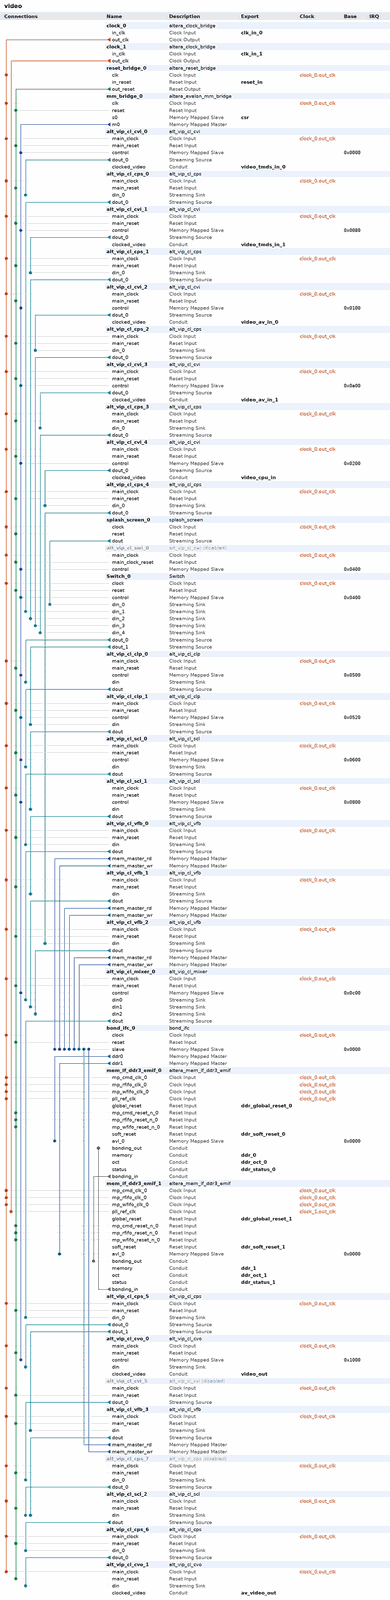
[diagram p0: system contents, whole]
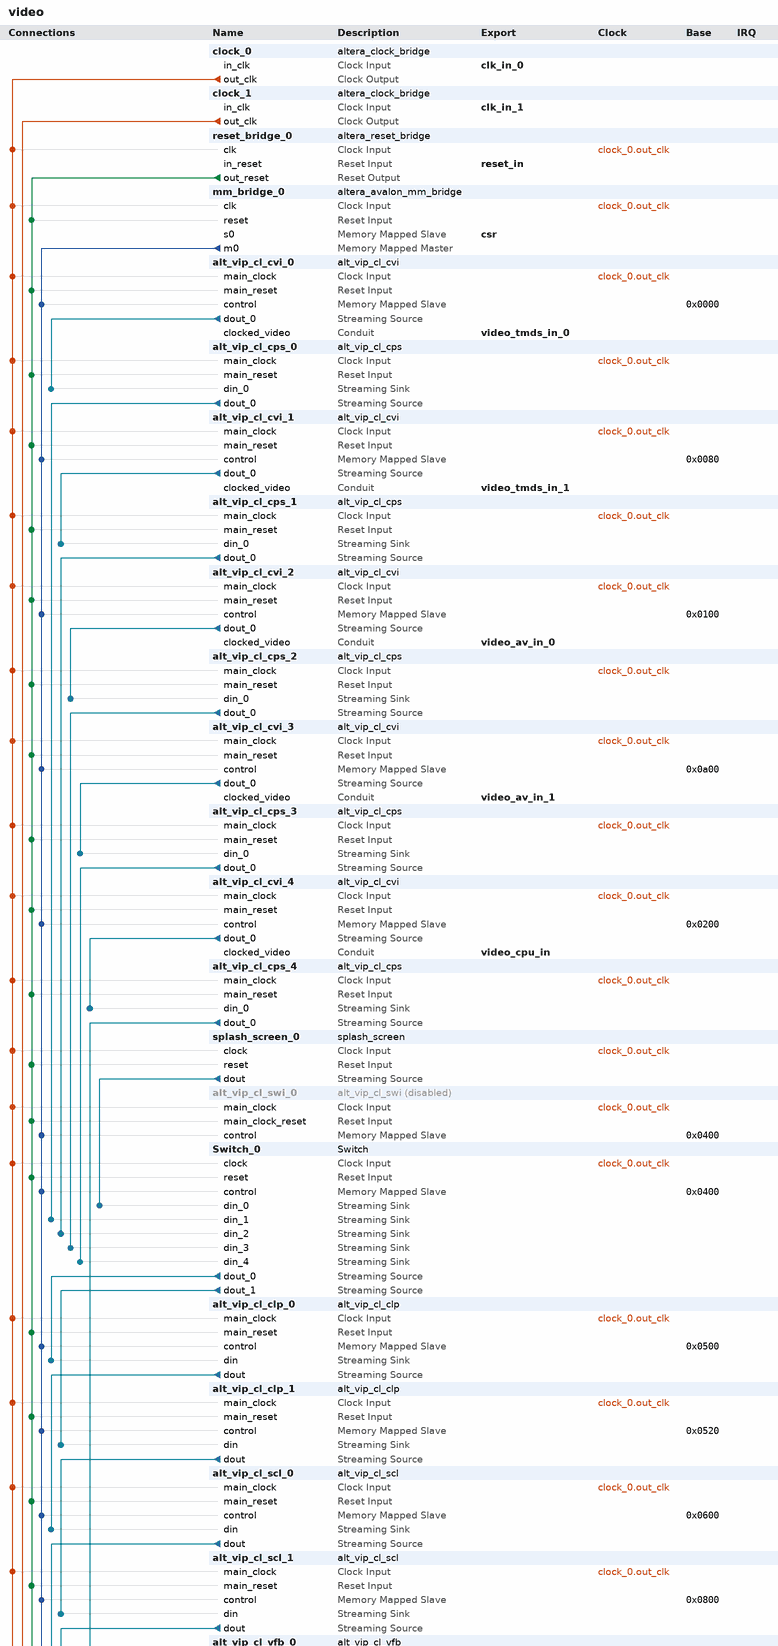
[diagram p1: system contents, upper part]
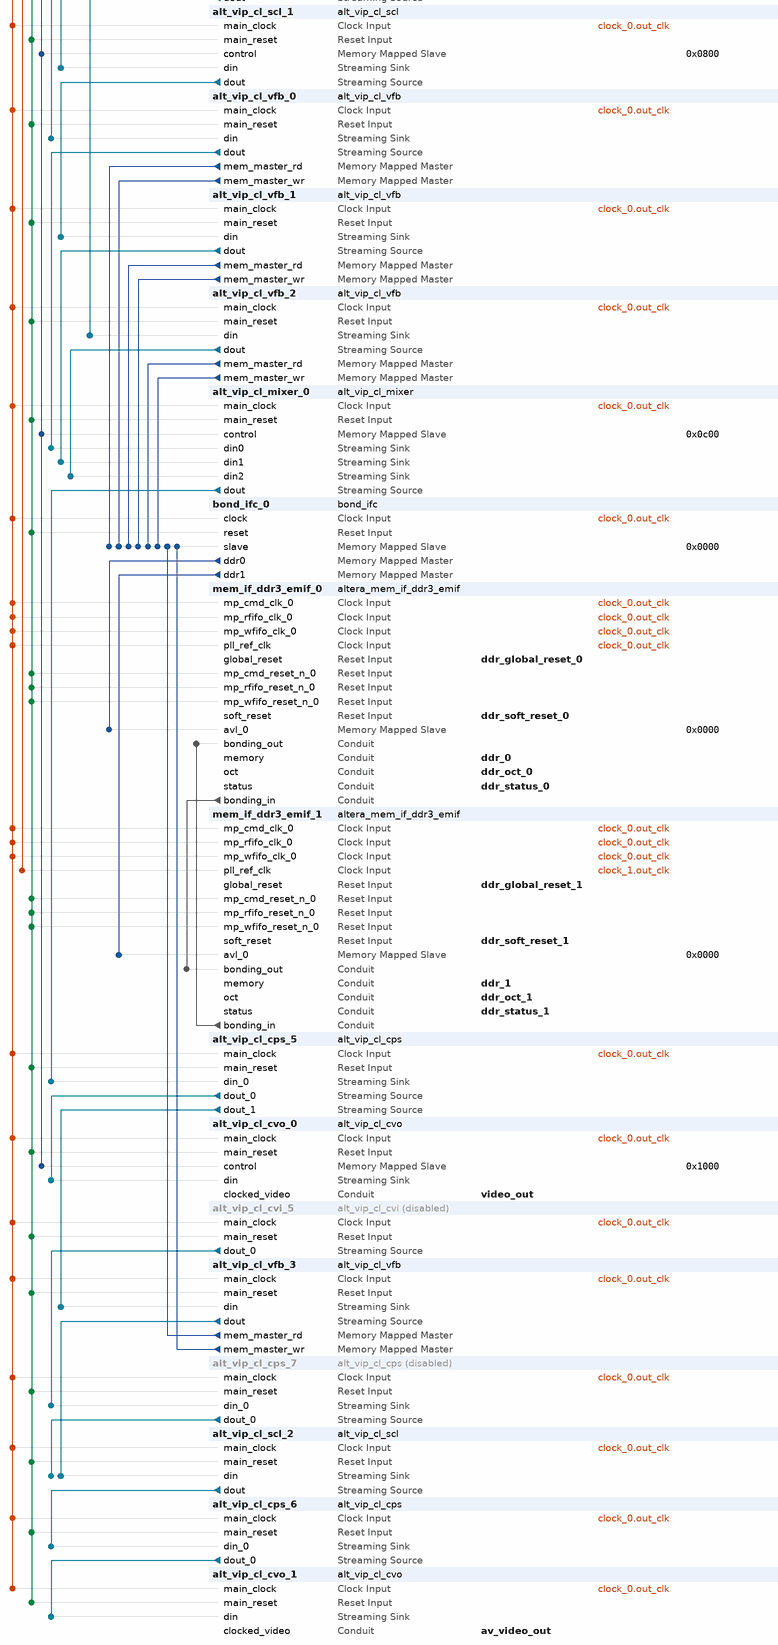
[diagram p2: system contents, lower part]
# Platform Designer (Qsys) system video, Cyclone V 5CGXFC7D6F31I7
# Parameters at their usual value, and those the tool derives, are not listed.
package require -exact qsys 18.1
create_system video
set_project_property DEVICE_FAMILY {Cyclone V}
set_project_property DEVICE 5CGXFC7D6F31I7

add_instance clock_0 altera_clock_bridge 18.1
set_instance_parameter_value clock_0 DERIVED_CLOCK_RATE 0
set_instance_parameter_value clock_0 EXPLICIT_CLOCK_RATE 100000000

add_instance clock_1 altera_clock_bridge 18.1
set_instance_parameter_value clock_1 DERIVED_CLOCK_RATE 0
set_instance_parameter_value clock_1 EXPLICIT_CLOCK_RATE 100000000

add_instance reset_bridge_0 altera_reset_bridge 18.1
set_instance_parameter_value reset_bridge_0 ACTIVE_LOW_RESET 1
set_instance_parameter_value reset_bridge_0 SYNCHRONOUS_EDGES deassert

add_instance mm_bridge_0 altera_avalon_mm_bridge 18.1
set_instance_parameter_value mm_bridge_0 ADDRESS_UNITS WORDS
set_instance_parameter_value mm_bridge_0 ADDRESS_WIDTH 10
set_instance_parameter_value mm_bridge_0 DATA_WIDTH 32
set_instance_parameter_value mm_bridge_0 MAX_PENDING_RESPONSES 4
set_instance_parameter_value mm_bridge_0 USE_AUTO_ADDRESS_WIDTH 1

add_instance alt_vip_cl_cvi_0 alt_vip_cl_cvi 18.1
set_instance_parameter_value alt_vip_cl_cvi_0 ACCEPT_COLOURS_IN_SEQ 0
set_instance_parameter_value alt_vip_cl_cvi_0 ANC_DEPTH 1
set_instance_parameter_value alt_vip_cl_cvi_0 BPS 8
set_instance_parameter_value alt_vip_cl_cvi_0 CLOCKS_ARE_SAME 0
set_instance_parameter_value alt_vip_cl_cvi_0 COLOUR_PLANES_ARE_IN_PARALLEL 1
set_instance_parameter_value alt_vip_cl_cvi_0 EXTRACT_TOTAL_RESOLUTION 1
set_instance_parameter_value alt_vip_cl_cvi_0 FIFO_DEPTH 128
set_instance_parameter_value alt_vip_cl_cvi_0 GENERATE_ANC 0
set_instance_parameter_value alt_vip_cl_cvi_0 GENERATE_VID_F 0
set_instance_parameter_value alt_vip_cl_cvi_0 H_ACTIVE_PIXELS_F0 1920
set_instance_parameter_value alt_vip_cl_cvi_0 INTERLACED 0
set_instance_parameter_value alt_vip_cl_cvi_0 MATCH_CTRLDATA_PKT_CLIP_BASIC 0
set_instance_parameter_value alt_vip_cl_cvi_0 MATCH_CTRLDATA_PKT_PAD_ADV 0
set_instance_parameter_value alt_vip_cl_cvi_0 NO_OF_CHANNELS 1
set_instance_parameter_value alt_vip_cl_cvi_0 NUMBER_OF_COLOUR_PLANES 3
set_instance_parameter_value alt_vip_cl_cvi_0 OVERFLOW_HANDLING 0
set_instance_parameter_value alt_vip_cl_cvi_0 PIXELS_IN_PARALLEL 2
set_instance_parameter_value alt_vip_cl_cvi_0 STD_WIDTH 1
set_instance_parameter_value alt_vip_cl_cvi_0 SYNC_TO 0
set_instance_parameter_value alt_vip_cl_cvi_0 USE_CONTROL 1
set_instance_parameter_value alt_vip_cl_cvi_0 USE_EMBEDDED_SYNCS 0
set_instance_parameter_value alt_vip_cl_cvi_0 USE_HDMI_DEPRICATION 0
set_instance_parameter_value alt_vip_cl_cvi_0 USE_STD 0
set_instance_parameter_value alt_vip_cl_cvi_0 V_ACTIVE_LINES_F0 1080
set_instance_parameter_value alt_vip_cl_cvi_0 V_ACTIVE_LINES_F1 480

add_instance alt_vip_cl_cps_0 alt_vip_cl_cps 18.1
set_instance_parameter_value alt_vip_cl_cps_0 BITS_PER_SYMBOL 8
set_instance_parameter_value alt_vip_cl_cps_0 EXTRA_PIPELINING 0
set_instance_parameter_value alt_vip_cl_cps_0 INPUT_0_COLOR_PLANES_ARE_IN_PARALLEL 1
set_instance_parameter_value alt_vip_cl_cps_0 INPUT_0_FIFO 0
set_instance_parameter_value alt_vip_cl_cps_0 INPUT_0_FIFO_SIZE 8
set_instance_parameter_value alt_vip_cl_cps_0 INPUT_0_NUMBER_OF_COLOR_PLANES 3
set_instance_parameter_value alt_vip_cl_cps_0 INPUT_0_PATTERN C0,C1,C2
set_instance_parameter_value alt_vip_cl_cps_0 INPUT_0_PIXELS_IN_PARALLEL 2
set_instance_parameter_value alt_vip_cl_cps_0 INPUT_0_TWO_PIXELS_PATTERN 0
set_instance_parameter_value alt_vip_cl_cps_0 INPUT_1_COLOR_PLANES_ARE_IN_PARALLEL 1
set_instance_parameter_value alt_vip_cl_cps_0 INPUT_1_FIFO 0
set_instance_parameter_value alt_vip_cl_cps_0 INPUT_1_FIFO_SIZE 8
set_instance_parameter_value alt_vip_cl_cps_0 INPUT_1_NUMBER_OF_COLOR_PLANES 3
set_instance_parameter_value alt_vip_cl_cps_0 INPUT_1_PATTERN C0,C1,C2
set_instance_parameter_value alt_vip_cl_cps_0 INPUT_1_PIXELS_IN_PARALLEL 1
set_instance_parameter_value alt_vip_cl_cps_0 INPUT_1_TWO_PIXELS_PATTERN 0
set_instance_parameter_value alt_vip_cl_cps_0 INPUT_VALIDATION 1
set_instance_parameter_value alt_vip_cl_cps_0 NUMBER_OF_INPUTS 1
set_instance_parameter_value alt_vip_cl_cps_0 NUMBER_OF_OUTPUTS 1
set_instance_parameter_value alt_vip_cl_cps_0 OUTPUT_0_COLOR_PLANES_ARE_IN_PARALLEL 1
set_instance_parameter_value alt_vip_cl_cps_0 OUTPUT_0_FIFO 0
set_instance_parameter_value alt_vip_cl_cps_0 OUTPUT_0_FIFO_SIZE 8
set_instance_parameter_value alt_vip_cl_cps_0 OUTPUT_0_NUMBER_OF_COLOR_PLANES 3
set_instance_parameter_value alt_vip_cl_cps_0 OUTPUT_0_PATTERN C0,C1,C2
set_instance_parameter_value alt_vip_cl_cps_0 OUTPUT_0_PIXELS_IN_PARALLEL 4
set_instance_parameter_value alt_vip_cl_cps_0 OUTPUT_0_TWO_PIXELS_PATTERN 0
set_instance_parameter_value alt_vip_cl_cps_0 OUTPUT_1_COLOR_PLANES_ARE_IN_PARALLEL 1
set_instance_parameter_value alt_vip_cl_cps_0 OUTPUT_1_FIFO 0
set_instance_parameter_value alt_vip_cl_cps_0 OUTPUT_1_FIFO_SIZE 8
set_instance_parameter_value alt_vip_cl_cps_0 OUTPUT_1_NUMBER_OF_COLOR_PLANES 3
set_instance_parameter_value alt_vip_cl_cps_0 OUTPUT_1_PATTERN C0,C1,C2
set_instance_parameter_value alt_vip_cl_cps_0 OUTPUT_1_PIXELS_IN_PARALLEL 1
set_instance_parameter_value alt_vip_cl_cps_0 OUTPUT_1_TWO_PIXELS_PATTERN 0
set_instance_parameter_value alt_vip_cl_cps_0 OUTPUT_VALIDATION 1
set_instance_parameter_value alt_vip_cl_cps_0 USER_PACKET_SUPPORT NONE_ALLOWED
set_instance_parameter_value alt_vip_cl_cps_0 USER_PKT_0_TO_0 0
set_instance_parameter_value alt_vip_cl_cps_0 USER_PKT_0_TO_1 0
set_instance_parameter_value alt_vip_cl_cps_0 USER_PKT_1_TO_0 0
set_instance_parameter_value alt_vip_cl_cps_0 USER_PKT_1_TO_1 1

add_instance alt_vip_cl_cvi_1 alt_vip_cl_cvi 18.1
set_instance_parameter_value alt_vip_cl_cvi_1 ACCEPT_COLOURS_IN_SEQ 0
set_instance_parameter_value alt_vip_cl_cvi_1 ANC_DEPTH 1
set_instance_parameter_value alt_vip_cl_cvi_1 BPS 8
set_instance_parameter_value alt_vip_cl_cvi_1 CLOCKS_ARE_SAME 0
set_instance_parameter_value alt_vip_cl_cvi_1 COLOUR_PLANES_ARE_IN_PARALLEL 1
set_instance_parameter_value alt_vip_cl_cvi_1 EXTRACT_TOTAL_RESOLUTION 1
set_instance_parameter_value alt_vip_cl_cvi_1 FIFO_DEPTH 128
set_instance_parameter_value alt_vip_cl_cvi_1 GENERATE_ANC 0
set_instance_parameter_value alt_vip_cl_cvi_1 GENERATE_VID_F 0
set_instance_parameter_value alt_vip_cl_cvi_1 H_ACTIVE_PIXELS_F0 1920
set_instance_parameter_value alt_vip_cl_cvi_1 INTERLACED 0
set_instance_parameter_value alt_vip_cl_cvi_1 MATCH_CTRLDATA_PKT_CLIP_BASIC 0
set_instance_parameter_value alt_vip_cl_cvi_1 MATCH_CTRLDATA_PKT_PAD_ADV 0
set_instance_parameter_value alt_vip_cl_cvi_1 NO_OF_CHANNELS 1
set_instance_parameter_value alt_vip_cl_cvi_1 NUMBER_OF_COLOUR_PLANES 3
set_instance_parameter_value alt_vip_cl_cvi_1 OVERFLOW_HANDLING 0
set_instance_parameter_value alt_vip_cl_cvi_1 PIXELS_IN_PARALLEL 2
set_instance_parameter_value alt_vip_cl_cvi_1 STD_WIDTH 1
set_instance_parameter_value alt_vip_cl_cvi_1 SYNC_TO 0
set_instance_parameter_value alt_vip_cl_cvi_1 USE_CONTROL 1
set_instance_parameter_value alt_vip_cl_cvi_1 USE_EMBEDDED_SYNCS 0
set_instance_parameter_value alt_vip_cl_cvi_1 USE_HDMI_DEPRICATION 0
set_instance_parameter_value alt_vip_cl_cvi_1 USE_STD 0
set_instance_parameter_value alt_vip_cl_cvi_1 V_ACTIVE_LINES_F0 1080
set_instance_parameter_value alt_vip_cl_cvi_1 V_ACTIVE_LINES_F1 480

add_instance alt_vip_cl_cps_1 alt_vip_cl_cps 18.1
set_instance_parameter_value alt_vip_cl_cps_1 BITS_PER_SYMBOL 8
set_instance_parameter_value alt_vip_cl_cps_1 EXTRA_PIPELINING 0
set_instance_parameter_value alt_vip_cl_cps_1 INPUT_0_COLOR_PLANES_ARE_IN_PARALLEL 1
set_instance_parameter_value alt_vip_cl_cps_1 INPUT_0_FIFO 0
set_instance_parameter_value alt_vip_cl_cps_1 INPUT_0_FIFO_SIZE 8
set_instance_parameter_value alt_vip_cl_cps_1 INPUT_0_NUMBER_OF_COLOR_PLANES 3
set_instance_parameter_value alt_vip_cl_cps_1 INPUT_0_PATTERN C0,C1,C2
set_instance_parameter_value alt_vip_cl_cps_1 INPUT_0_PIXELS_IN_PARALLEL 2
set_instance_parameter_value alt_vip_cl_cps_1 INPUT_0_TWO_PIXELS_PATTERN 0
set_instance_parameter_value alt_vip_cl_cps_1 INPUT_1_COLOR_PLANES_ARE_IN_PARALLEL 1
set_instance_parameter_value alt_vip_cl_cps_1 INPUT_1_FIFO 0
set_instance_parameter_value alt_vip_cl_cps_1 INPUT_1_FIFO_SIZE 8
set_instance_parameter_value alt_vip_cl_cps_1 INPUT_1_NUMBER_OF_COLOR_PLANES 3
set_instance_parameter_value alt_vip_cl_cps_1 INPUT_1_PATTERN C0,C1,C2
set_instance_parameter_value alt_vip_cl_cps_1 INPUT_1_PIXELS_IN_PARALLEL 1
set_instance_parameter_value alt_vip_cl_cps_1 INPUT_1_TWO_PIXELS_PATTERN 0
set_instance_parameter_value alt_vip_cl_cps_1 INPUT_VALIDATION 1
set_instance_parameter_value alt_vip_cl_cps_1 NUMBER_OF_INPUTS 1
set_instance_parameter_value alt_vip_cl_cps_1 NUMBER_OF_OUTPUTS 1
set_instance_parameter_value alt_vip_cl_cps_1 OUTPUT_0_COLOR_PLANES_ARE_IN_PARALLEL 1
set_instance_parameter_value alt_vip_cl_cps_1 OUTPUT_0_FIFO 0
set_instance_parameter_value alt_vip_cl_cps_1 OUTPUT_0_FIFO_SIZE 8
set_instance_parameter_value alt_vip_cl_cps_1 OUTPUT_0_NUMBER_OF_COLOR_PLANES 3
set_instance_parameter_value alt_vip_cl_cps_1 OUTPUT_0_PATTERN C0,C1,C2
set_instance_parameter_value alt_vip_cl_cps_1 OUTPUT_0_PIXELS_IN_PARALLEL 4
set_instance_parameter_value alt_vip_cl_cps_1 OUTPUT_0_TWO_PIXELS_PATTERN 0
set_instance_parameter_value alt_vip_cl_cps_1 OUTPUT_1_COLOR_PLANES_ARE_IN_PARALLEL 1
set_instance_parameter_value alt_vip_cl_cps_1 OUTPUT_1_FIFO 0
set_instance_parameter_value alt_vip_cl_cps_1 OUTPUT_1_FIFO_SIZE 8
set_instance_parameter_value alt_vip_cl_cps_1 OUTPUT_1_NUMBER_OF_COLOR_PLANES 3
set_instance_parameter_value alt_vip_cl_cps_1 OUTPUT_1_PATTERN C0,C1,C2
set_instance_parameter_value alt_vip_cl_cps_1 OUTPUT_1_PIXELS_IN_PARALLEL 1
set_instance_parameter_value alt_vip_cl_cps_1 OUTPUT_1_TWO_PIXELS_PATTERN 0
set_instance_parameter_value alt_vip_cl_cps_1 OUTPUT_VALIDATION 1
set_instance_parameter_value alt_vip_cl_cps_1 USER_PACKET_SUPPORT NONE_ALLOWED
set_instance_parameter_value alt_vip_cl_cps_1 USER_PKT_0_TO_0 0
set_instance_parameter_value alt_vip_cl_cps_1 USER_PKT_0_TO_1 0
set_instance_parameter_value alt_vip_cl_cps_1 USER_PKT_1_TO_0 0
set_instance_parameter_value alt_vip_cl_cps_1 USER_PKT_1_TO_1 1

add_instance alt_vip_cl_cvi_2 alt_vip_cl_cvi 18.1
set_instance_parameter_value alt_vip_cl_cvi_2 ACCEPT_COLOURS_IN_SEQ 0
set_instance_parameter_value alt_vip_cl_cvi_2 ANC_DEPTH 1
set_instance_parameter_value alt_vip_cl_cvi_2 BPS 8
set_instance_parameter_value alt_vip_cl_cvi_2 CLOCKS_ARE_SAME 0
set_instance_parameter_value alt_vip_cl_cvi_2 COLOUR_PLANES_ARE_IN_PARALLEL 1
set_instance_parameter_value alt_vip_cl_cvi_2 EXTRACT_TOTAL_RESOLUTION 1
set_instance_parameter_value alt_vip_cl_cvi_2 FIFO_DEPTH 2048
set_instance_parameter_value alt_vip_cl_cvi_2 GENERATE_ANC 0
set_instance_parameter_value alt_vip_cl_cvi_2 GENERATE_VID_F 0
set_instance_parameter_value alt_vip_cl_cvi_2 H_ACTIVE_PIXELS_F0 1920
set_instance_parameter_value alt_vip_cl_cvi_2 INTERLACED 0
set_instance_parameter_value alt_vip_cl_cvi_2 MATCH_CTRLDATA_PKT_CLIP_BASIC 0
set_instance_parameter_value alt_vip_cl_cvi_2 MATCH_CTRLDATA_PKT_PAD_ADV 0
set_instance_parameter_value alt_vip_cl_cvi_2 NO_OF_CHANNELS 1
set_instance_parameter_value alt_vip_cl_cvi_2 NUMBER_OF_COLOUR_PLANES 3
set_instance_parameter_value alt_vip_cl_cvi_2 OVERFLOW_HANDLING 0
set_instance_parameter_value alt_vip_cl_cvi_2 PIXELS_IN_PARALLEL 1
set_instance_parameter_value alt_vip_cl_cvi_2 STD_WIDTH 1
set_instance_parameter_value alt_vip_cl_cvi_2 SYNC_TO 0
set_instance_parameter_value alt_vip_cl_cvi_2 USE_CONTROL 1
set_instance_parameter_value alt_vip_cl_cvi_2 USE_EMBEDDED_SYNCS 0
set_instance_parameter_value alt_vip_cl_cvi_2 USE_HDMI_DEPRICATION 0
set_instance_parameter_value alt_vip_cl_cvi_2 USE_STD 0
set_instance_parameter_value alt_vip_cl_cvi_2 V_ACTIVE_LINES_F0 1080
set_instance_parameter_value alt_vip_cl_cvi_2 V_ACTIVE_LINES_F1 480

add_instance alt_vip_cl_cps_2 alt_vip_cl_cps 18.1
set_instance_parameter_value alt_vip_cl_cps_2 BITS_PER_SYMBOL 8
set_instance_parameter_value alt_vip_cl_cps_2 EXTRA_PIPELINING 0
set_instance_parameter_value alt_vip_cl_cps_2 INPUT_0_COLOR_PLANES_ARE_IN_PARALLEL 1
set_instance_parameter_value alt_vip_cl_cps_2 INPUT_0_FIFO 0
set_instance_parameter_value alt_vip_cl_cps_2 INPUT_0_FIFO_SIZE 128
set_instance_parameter_value alt_vip_cl_cps_2 INPUT_0_NUMBER_OF_COLOR_PLANES 3
set_instance_parameter_value alt_vip_cl_cps_2 INPUT_0_PATTERN C0,C1,C2
set_instance_parameter_value alt_vip_cl_cps_2 INPUT_0_PIXELS_IN_PARALLEL 1
set_instance_parameter_value alt_vip_cl_cps_2 INPUT_0_TWO_PIXELS_PATTERN 0
set_instance_parameter_value alt_vip_cl_cps_2 INPUT_1_COLOR_PLANES_ARE_IN_PARALLEL 1
set_instance_parameter_value alt_vip_cl_cps_2 INPUT_1_FIFO 0
set_instance_parameter_value alt_vip_cl_cps_2 INPUT_1_FIFO_SIZE 8
set_instance_parameter_value alt_vip_cl_cps_2 INPUT_1_NUMBER_OF_COLOR_PLANES 3
set_instance_parameter_value alt_vip_cl_cps_2 INPUT_1_PATTERN C0,C1,C2
set_instance_parameter_value alt_vip_cl_cps_2 INPUT_1_PIXELS_IN_PARALLEL 1
set_instance_parameter_value alt_vip_cl_cps_2 INPUT_1_TWO_PIXELS_PATTERN 0
set_instance_parameter_value alt_vip_cl_cps_2 INPUT_VALIDATION 1
set_instance_parameter_value alt_vip_cl_cps_2 NUMBER_OF_INPUTS 1
set_instance_parameter_value alt_vip_cl_cps_2 NUMBER_OF_OUTPUTS 1
set_instance_parameter_value alt_vip_cl_cps_2 OUTPUT_0_COLOR_PLANES_ARE_IN_PARALLEL 1
set_instance_parameter_value alt_vip_cl_cps_2 OUTPUT_0_FIFO 0
set_instance_parameter_value alt_vip_cl_cps_2 OUTPUT_0_FIFO_SIZE 128
set_instance_parameter_value alt_vip_cl_cps_2 OUTPUT_0_NUMBER_OF_COLOR_PLANES 3
set_instance_parameter_value alt_vip_cl_cps_2 OUTPUT_0_PATTERN C0,C1,C2
set_instance_parameter_value alt_vip_cl_cps_2 OUTPUT_0_PIXELS_IN_PARALLEL 4
set_instance_parameter_value alt_vip_cl_cps_2 OUTPUT_0_TWO_PIXELS_PATTERN 0
set_instance_parameter_value alt_vip_cl_cps_2 OUTPUT_1_COLOR_PLANES_ARE_IN_PARALLEL 1
set_instance_parameter_value alt_vip_cl_cps_2 OUTPUT_1_FIFO 0
set_instance_parameter_value alt_vip_cl_cps_2 OUTPUT_1_FIFO_SIZE 8
set_instance_parameter_value alt_vip_cl_cps_2 OUTPUT_1_NUMBER_OF_COLOR_PLANES 3
set_instance_parameter_value alt_vip_cl_cps_2 OUTPUT_1_PATTERN C0,C1,C2
set_instance_parameter_value alt_vip_cl_cps_2 OUTPUT_1_PIXELS_IN_PARALLEL 1
set_instance_parameter_value alt_vip_cl_cps_2 OUTPUT_1_TWO_PIXELS_PATTERN 0
set_instance_parameter_value alt_vip_cl_cps_2 OUTPUT_VALIDATION 1
set_instance_parameter_value alt_vip_cl_cps_2 USER_PACKET_SUPPORT NONE_ALLOWED
set_instance_parameter_value alt_vip_cl_cps_2 USER_PKT_0_TO_0 0
set_instance_parameter_value alt_vip_cl_cps_2 USER_PKT_0_TO_1 0
set_instance_parameter_value alt_vip_cl_cps_2 USER_PKT_1_TO_0 0
set_instance_parameter_value alt_vip_cl_cps_2 USER_PKT_1_TO_1 1

add_instance alt_vip_cl_cvi_3 alt_vip_cl_cvi 18.1
set_instance_parameter_value alt_vip_cl_cvi_3 ACCEPT_COLOURS_IN_SEQ 0
set_instance_parameter_value alt_vip_cl_cvi_3 ANC_DEPTH 1
set_instance_parameter_value alt_vip_cl_cvi_3 BPS 8
set_instance_parameter_value alt_vip_cl_cvi_3 CLOCKS_ARE_SAME 0
set_instance_parameter_value alt_vip_cl_cvi_3 COLOUR_PLANES_ARE_IN_PARALLEL 1
set_instance_parameter_value alt_vip_cl_cvi_3 EXTRACT_TOTAL_RESOLUTION 1
set_instance_parameter_value alt_vip_cl_cvi_3 FIFO_DEPTH 2048
set_instance_parameter_value alt_vip_cl_cvi_3 GENERATE_ANC 0
set_instance_parameter_value alt_vip_cl_cvi_3 GENERATE_VID_F 0
set_instance_parameter_value alt_vip_cl_cvi_3 H_ACTIVE_PIXELS_F0 1920
set_instance_parameter_value alt_vip_cl_cvi_3 INTERLACED 0
set_instance_parameter_value alt_vip_cl_cvi_3 MATCH_CTRLDATA_PKT_CLIP_BASIC 0
set_instance_parameter_value alt_vip_cl_cvi_3 MATCH_CTRLDATA_PKT_PAD_ADV 0
set_instance_parameter_value alt_vip_cl_cvi_3 NO_OF_CHANNELS 1
set_instance_parameter_value alt_vip_cl_cvi_3 NUMBER_OF_COLOUR_PLANES 3
set_instance_parameter_value alt_vip_cl_cvi_3 OVERFLOW_HANDLING 0
set_instance_parameter_value alt_vip_cl_cvi_3 PIXELS_IN_PARALLEL 1
set_instance_parameter_value alt_vip_cl_cvi_3 STD_WIDTH 1
set_instance_parameter_value alt_vip_cl_cvi_3 SYNC_TO 0
set_instance_parameter_value alt_vip_cl_cvi_3 USE_CONTROL 1
set_instance_parameter_value alt_vip_cl_cvi_3 USE_EMBEDDED_SYNCS 0
set_instance_parameter_value alt_vip_cl_cvi_3 USE_HDMI_DEPRICATION 0
set_instance_parameter_value alt_vip_cl_cvi_3 USE_STD 0
set_instance_parameter_value alt_vip_cl_cvi_3 V_ACTIVE_LINES_F0 1080
set_instance_parameter_value alt_vip_cl_cvi_3 V_ACTIVE_LINES_F1 480

add_instance alt_vip_cl_cps_3 alt_vip_cl_cps 18.1
set_instance_parameter_value alt_vip_cl_cps_3 BITS_PER_SYMBOL 8
set_instance_parameter_value alt_vip_cl_cps_3 EXTRA_PIPELINING 0
set_instance_parameter_value alt_vip_cl_cps_3 INPUT_0_COLOR_PLANES_ARE_IN_PARALLEL 1
set_instance_parameter_value alt_vip_cl_cps_3 INPUT_0_FIFO 0
set_instance_parameter_value alt_vip_cl_cps_3 INPUT_0_FIFO_SIZE 128
set_instance_parameter_value alt_vip_cl_cps_3 INPUT_0_NUMBER_OF_COLOR_PLANES 3
set_instance_parameter_value alt_vip_cl_cps_3 INPUT_0_PATTERN C0,C1,C2
set_instance_parameter_value alt_vip_cl_cps_3 INPUT_0_PIXELS_IN_PARALLEL 1
set_instance_parameter_value alt_vip_cl_cps_3 INPUT_0_TWO_PIXELS_PATTERN 0
set_instance_parameter_value alt_vip_cl_cps_3 INPUT_1_COLOR_PLANES_ARE_IN_PARALLEL 1
set_instance_parameter_value alt_vip_cl_cps_3 INPUT_1_FIFO 0
set_instance_parameter_value alt_vip_cl_cps_3 INPUT_1_FIFO_SIZE 8
set_instance_parameter_value alt_vip_cl_cps_3 INPUT_1_NUMBER_OF_COLOR_PLANES 3
set_instance_parameter_value alt_vip_cl_cps_3 INPUT_1_PATTERN C0,C1,C2
set_instance_parameter_value alt_vip_cl_cps_3 INPUT_1_PIXELS_IN_PARALLEL 1
set_instance_parameter_value alt_vip_cl_cps_3 INPUT_1_TWO_PIXELS_PATTERN 0
set_instance_parameter_value alt_vip_cl_cps_3 INPUT_VALIDATION 1
set_instance_parameter_value alt_vip_cl_cps_3 NUMBER_OF_INPUTS 1
set_instance_parameter_value alt_vip_cl_cps_3 NUMBER_OF_OUTPUTS 1
set_instance_parameter_value alt_vip_cl_cps_3 OUTPUT_0_COLOR_PLANES_ARE_IN_PARALLEL 1
set_instance_parameter_value alt_vip_cl_cps_3 OUTPUT_0_FIFO 0
set_instance_parameter_value alt_vip_cl_cps_3 OUTPUT_0_FIFO_SIZE 128
set_instance_parameter_value alt_vip_cl_cps_3 OUTPUT_0_NUMBER_OF_COLOR_PLANES 3
set_instance_parameter_value alt_vip_cl_cps_3 OUTPUT_0_PATTERN C0,C1,C2
set_instance_parameter_value alt_vip_cl_cps_3 OUTPUT_0_PIXELS_IN_PARALLEL 4
set_instance_parameter_value alt_vip_cl_cps_3 OUTPUT_0_TWO_PIXELS_PATTERN 0
set_instance_parameter_value alt_vip_cl_cps_3 OUTPUT_1_COLOR_PLANES_ARE_IN_PARALLEL 1
set_instance_parameter_value alt_vip_cl_cps_3 OUTPUT_1_FIFO 0
set_instance_parameter_value alt_vip_cl_cps_3 OUTPUT_1_FIFO_SIZE 8
set_instance_parameter_value alt_vip_cl_cps_3 OUTPUT_1_NUMBER_OF_COLOR_PLANES 3
set_instance_parameter_value alt_vip_cl_cps_3 OUTPUT_1_PATTERN C0,C1,C2
set_instance_parameter_value alt_vip_cl_cps_3 OUTPUT_1_PIXELS_IN_PARALLEL 1
set_instance_parameter_value alt_vip_cl_cps_3 OUTPUT_1_TWO_PIXELS_PATTERN 0
set_instance_parameter_value alt_vip_cl_cps_3 OUTPUT_VALIDATION 1
set_instance_parameter_value alt_vip_cl_cps_3 USER_PACKET_SUPPORT NONE_ALLOWED
set_instance_parameter_value alt_vip_cl_cps_3 USER_PKT_0_TO_0 0
set_instance_parameter_value alt_vip_cl_cps_3 USER_PKT_0_TO_1 0
set_instance_parameter_value alt_vip_cl_cps_3 USER_PKT_1_TO_0 0
set_instance_parameter_value alt_vip_cl_cps_3 USER_PKT_1_TO_1 1

add_instance alt_vip_cl_cvi_4 alt_vip_cl_cvi 18.1
set_instance_parameter_value alt_vip_cl_cvi_4 ACCEPT_COLOURS_IN_SEQ 0
set_instance_parameter_value alt_vip_cl_cvi_4 ANC_DEPTH 1
set_instance_parameter_value alt_vip_cl_cvi_4 BPS 8
set_instance_parameter_value alt_vip_cl_cvi_4 CLOCKS_ARE_SAME 0
set_instance_parameter_value alt_vip_cl_cvi_4 COLOUR_PLANES_ARE_IN_PARALLEL 1
set_instance_parameter_value alt_vip_cl_cvi_4 EXTRACT_TOTAL_RESOLUTION 1
set_instance_parameter_value alt_vip_cl_cvi_4 FIFO_DEPTH 128
set_instance_parameter_value alt_vip_cl_cvi_4 GENERATE_ANC 0
set_instance_parameter_value alt_vip_cl_cvi_4 GENERATE_VID_F 0
set_instance_parameter_value alt_vip_cl_cvi_4 H_ACTIVE_PIXELS_F0 1920
set_instance_parameter_value alt_vip_cl_cvi_4 INTERLACED 0
set_instance_parameter_value alt_vip_cl_cvi_4 MATCH_CTRLDATA_PKT_CLIP_BASIC 0
set_instance_parameter_value alt_vip_cl_cvi_4 MATCH_CTRLDATA_PKT_PAD_ADV 0
set_instance_parameter_value alt_vip_cl_cvi_4 NO_OF_CHANNELS 1
set_instance_parameter_value alt_vip_cl_cvi_4 NUMBER_OF_COLOUR_PLANES 4
set_instance_parameter_value alt_vip_cl_cvi_4 OVERFLOW_HANDLING 0
set_instance_parameter_value alt_vip_cl_cvi_4 PIXELS_IN_PARALLEL 1
set_instance_parameter_value alt_vip_cl_cvi_4 STD_WIDTH 1
set_instance_parameter_value alt_vip_cl_cvi_4 SYNC_TO 0
set_instance_parameter_value alt_vip_cl_cvi_4 USE_CONTROL 1
set_instance_parameter_value alt_vip_cl_cvi_4 USE_EMBEDDED_SYNCS 0
set_instance_parameter_value alt_vip_cl_cvi_4 USE_HDMI_DEPRICATION 0
set_instance_parameter_value alt_vip_cl_cvi_4 USE_STD 0
set_instance_parameter_value alt_vip_cl_cvi_4 V_ACTIVE_LINES_F0 1080
set_instance_parameter_value alt_vip_cl_cvi_4 V_ACTIVE_LINES_F1 480

add_instance alt_vip_cl_cps_4 alt_vip_cl_cps 18.1
set_instance_parameter_value alt_vip_cl_cps_4 BITS_PER_SYMBOL 8
set_instance_parameter_value alt_vip_cl_cps_4 EXTRA_PIPELINING 0
set_instance_parameter_value alt_vip_cl_cps_4 INPUT_0_COLOR_PLANES_ARE_IN_PARALLEL 1
set_instance_parameter_value alt_vip_cl_cps_4 INPUT_0_FIFO 0
set_instance_parameter_value alt_vip_cl_cps_4 INPUT_0_FIFO_SIZE 8
set_instance_parameter_value alt_vip_cl_cps_4 INPUT_0_NUMBER_OF_COLOR_PLANES 4
set_instance_parameter_value alt_vip_cl_cps_4 INPUT_0_PATTERN C0,C1,C2,C3
set_instance_parameter_value alt_vip_cl_cps_4 INPUT_0_PIXELS_IN_PARALLEL 1
set_instance_parameter_value alt_vip_cl_cps_4 INPUT_0_TWO_PIXELS_PATTERN 0
set_instance_parameter_value alt_vip_cl_cps_4 INPUT_1_COLOR_PLANES_ARE_IN_PARALLEL 1
set_instance_parameter_value alt_vip_cl_cps_4 INPUT_1_FIFO 0
set_instance_parameter_value alt_vip_cl_cps_4 INPUT_1_FIFO_SIZE 8
set_instance_parameter_value alt_vip_cl_cps_4 INPUT_1_NUMBER_OF_COLOR_PLANES 3
set_instance_parameter_value alt_vip_cl_cps_4 INPUT_1_PATTERN C0,C1,C2
set_instance_parameter_value alt_vip_cl_cps_4 INPUT_1_PIXELS_IN_PARALLEL 1
set_instance_parameter_value alt_vip_cl_cps_4 INPUT_1_TWO_PIXELS_PATTERN 0
set_instance_parameter_value alt_vip_cl_cps_4 INPUT_VALIDATION 1
set_instance_parameter_value alt_vip_cl_cps_4 NUMBER_OF_INPUTS 1
set_instance_parameter_value alt_vip_cl_cps_4 NUMBER_OF_OUTPUTS 1
set_instance_parameter_value alt_vip_cl_cps_4 OUTPUT_0_COLOR_PLANES_ARE_IN_PARALLEL 1
set_instance_parameter_value alt_vip_cl_cps_4 OUTPUT_0_FIFO 0
set_instance_parameter_value alt_vip_cl_cps_4 OUTPUT_0_FIFO_SIZE 8
set_instance_parameter_value alt_vip_cl_cps_4 OUTPUT_0_NUMBER_OF_COLOR_PLANES 4
set_instance_parameter_value alt_vip_cl_cps_4 OUTPUT_0_PATTERN C0,C1,C2,C3
set_instance_parameter_value alt_vip_cl_cps_4 OUTPUT_0_PIXELS_IN_PARALLEL 4
set_instance_parameter_value alt_vip_cl_cps_4 OUTPUT_0_TWO_PIXELS_PATTERN 0
set_instance_parameter_value alt_vip_cl_cps_4 OUTPUT_1_COLOR_PLANES_ARE_IN_PARALLEL 1
set_instance_parameter_value alt_vip_cl_cps_4 OUTPUT_1_FIFO 0
set_instance_parameter_value alt_vip_cl_cps_4 OUTPUT_1_FIFO_SIZE 8
set_instance_parameter_value alt_vip_cl_cps_4 OUTPUT_1_NUMBER_OF_COLOR_PLANES 3
set_instance_parameter_value alt_vip_cl_cps_4 OUTPUT_1_PATTERN C0,C1,C2
set_instance_parameter_value alt_vip_cl_cps_4 OUTPUT_1_PIXELS_IN_PARALLEL 1
set_instance_parameter_value alt_vip_cl_cps_4 OUTPUT_1_TWO_PIXELS_PATTERN 0
set_instance_parameter_value alt_vip_cl_cps_4 OUTPUT_VALIDATION 1
set_instance_parameter_value alt_vip_cl_cps_4 USER_PACKET_SUPPORT NONE_ALLOWED
set_instance_parameter_value alt_vip_cl_cps_4 USER_PKT_0_TO_0 0
set_instance_parameter_value alt_vip_cl_cps_4 USER_PKT_0_TO_1 0
set_instance_parameter_value alt_vip_cl_cps_4 USER_PKT_1_TO_0 0
set_instance_parameter_value alt_vip_cl_cps_4 USER_PKT_1_TO_1 1

add_instance splash_screen_0 splash_screen 1.0
set_instance_parameter_value splash_screen_0 PIC_HEIGHT 160
set_instance_parameter_value splash_screen_0 PIC_MIF ../splashscreen.mif
set_instance_parameter_value splash_screen_0 PIC_WIDTH 400
set_instance_parameter_value splash_screen_0 PIXELS_IN_PARALLEL 4

add_instance alt_vip_cl_swi_0 alt_vip_cl_swi 18.1
set_instance_property alt_vip_cl_swi_0 ENABLED false
set_instance_parameter_value alt_vip_cl_swi_0 BITS_PER_SYMBOL 8
set_instance_parameter_value alt_vip_cl_swi_0 COLOR_PLANES_ARE_IN_PARALLEL 1
set_instance_parameter_value alt_vip_cl_swi_0 NO_OF_INPUTS 5
set_instance_parameter_value alt_vip_cl_swi_0 NO_OF_OUTPUTS 2
set_instance_parameter_value alt_vip_cl_swi_0 NUMBER_OF_COLOR_PLANES 3
set_instance_parameter_value alt_vip_cl_swi_0 PIXELS_IN_PARALLEL 4
set_instance_parameter_value alt_vip_cl_swi_0 READY_LATENCY 1

add_instance Switch_0 Switch 1.0
set_instance_parameter_value Switch_0 INPUT_NUMBER 5
set_instance_parameter_value Switch_0 OUTPUT_NUMBER 2
set_instance_parameter_value Switch_0 PIX_IN_PARALLEL 4

add_instance alt_vip_cl_clp_0 alt_vip_cl_clp 18.1
set_instance_parameter_value alt_vip_cl_clp_0 BITS_PER_SYMBOL 8
set_instance_parameter_value alt_vip_cl_clp_0 BOTTOM_OFFSET 0
set_instance_parameter_value alt_vip_cl_clp_0 CLIPPING_METHOD OFFSETS
set_instance_parameter_value alt_vip_cl_clp_0 COLOR_PLANES_ARE_IN_PARALLEL 1
set_instance_parameter_value alt_vip_cl_clp_0 EXTRA_PIPELINING 0
set_instance_parameter_value alt_vip_cl_clp_0 FAMILY {Cyclone V}
set_instance_parameter_value alt_vip_cl_clp_0 LEFT_OFFSET 0
set_instance_parameter_value alt_vip_cl_clp_0 LIMITED_READBACK 0
set_instance_parameter_value alt_vip_cl_clp_0 MAX_IN_HEIGHT 1080
set_instance_parameter_value alt_vip_cl_clp_0 MAX_IN_WIDTH 1920
set_instance_parameter_value alt_vip_cl_clp_0 NUMBER_OF_COLOR_PLANES 3
set_instance_parameter_value alt_vip_cl_clp_0 PIXELS_IN_PARALLEL 4
set_instance_parameter_value alt_vip_cl_clp_0 RECTANGLE_HEIGHT 1080
set_instance_parameter_value alt_vip_cl_clp_0 RECTANGLE_WIDTH 1920
set_instance_parameter_value alt_vip_cl_clp_0 RIGHT_OFFSET 0
set_instance_parameter_value alt_vip_cl_clp_0 RUNTIME_CONTROL 1
set_instance_parameter_value alt_vip_cl_clp_0 TOP_OFFSET 0
set_instance_parameter_value alt_vip_cl_clp_0 USER_PACKET_FIFO_DEPTH 0
set_instance_parameter_value alt_vip_cl_clp_0 USER_PACKET_SUPPORT NONE_ALLOWED

add_instance alt_vip_cl_clp_1 alt_vip_cl_clp 18.1
set_instance_parameter_value alt_vip_cl_clp_1 BITS_PER_SYMBOL 8
set_instance_parameter_value alt_vip_cl_clp_1 BOTTOM_OFFSET 0
set_instance_parameter_value alt_vip_cl_clp_1 CLIPPING_METHOD OFFSETS
set_instance_parameter_value alt_vip_cl_clp_1 COLOR_PLANES_ARE_IN_PARALLEL 1
set_instance_parameter_value alt_vip_cl_clp_1 EXTRA_PIPELINING 0
set_instance_parameter_value alt_vip_cl_clp_1 FAMILY {Cyclone V}
set_instance_parameter_value alt_vip_cl_clp_1 LEFT_OFFSET 0
set_instance_parameter_value alt_vip_cl_clp_1 LIMITED_READBACK 0
set_instance_parameter_value alt_vip_cl_clp_1 MAX_IN_HEIGHT 1080
set_instance_parameter_value alt_vip_cl_clp_1 MAX_IN_WIDTH 1920
set_instance_parameter_value alt_vip_cl_clp_1 NUMBER_OF_COLOR_PLANES 3
set_instance_parameter_value alt_vip_cl_clp_1 PIXELS_IN_PARALLEL 4
set_instance_parameter_value alt_vip_cl_clp_1 RECTANGLE_HEIGHT 1080
set_instance_parameter_value alt_vip_cl_clp_1 RECTANGLE_WIDTH 1920
set_instance_parameter_value alt_vip_cl_clp_1 RIGHT_OFFSET 0
set_instance_parameter_value alt_vip_cl_clp_1 RUNTIME_CONTROL 1
set_instance_parameter_value alt_vip_cl_clp_1 TOP_OFFSET 0
set_instance_parameter_value alt_vip_cl_clp_1 USER_PACKET_FIFO_DEPTH 0
set_instance_parameter_value alt_vip_cl_clp_1 USER_PACKET_SUPPORT NONE_ALLOWED

add_instance alt_vip_cl_scl_0 alt_vip_cl_scl 18.1
set_instance_parameter_value alt_vip_cl_scl_0 ALGORITHM_NAME BILINEAR
set_instance_parameter_value alt_vip_cl_scl_0 ALWAYS_DOWNSCALE 0
set_instance_parameter_value alt_vip_cl_scl_0 ARE_IDENTICAL 0
set_instance_parameter_value alt_vip_cl_scl_0 BITS_PER_SYMBOL 8
set_instance_parameter_value alt_vip_cl_scl_0 DEFAULT_EDGE_THRESH 7
set_instance_parameter_value alt_vip_cl_scl_0 DEFAULT_LOWER_BLUR 0
set_instance_parameter_value alt_vip_cl_scl_0 DEFAULT_UPPER_BLUR 0
set_instance_parameter_value alt_vip_cl_scl_0 ENABLE_FIR 0
set_instance_parameter_value alt_vip_cl_scl_0 EXTRA_PIPELINING 1
set_instance_parameter_value alt_vip_cl_scl_0 FAMILY {Cyclone V}
set_instance_parameter_value alt_vip_cl_scl_0 H_BANKS 1
set_instance_parameter_value alt_vip_cl_scl_0 H_COEFF_FILE {<enter file name (including full path)>}
set_instance_parameter_value alt_vip_cl_scl_0 H_FRACTION_BITS 7
set_instance_parameter_value alt_vip_cl_scl_0 H_FUNCTION LANCZOS_2
set_instance_parameter_value alt_vip_cl_scl_0 H_INTEGER_BITS 1
set_instance_parameter_value alt_vip_cl_scl_0 H_PHASES 16
set_instance_parameter_value alt_vip_cl_scl_0 H_SIGNED 1
set_instance_parameter_value alt_vip_cl_scl_0 H_SYMMETRIC 0
set_instance_parameter_value alt_vip_cl_scl_0 H_TAPS 8
set_instance_parameter_value alt_vip_cl_scl_0 IS_420 0
set_instance_parameter_value alt_vip_cl_scl_0 IS_422 0
set_instance_parameter_value alt_vip_cl_scl_0 LIMITED_READBACK 0
set_instance_parameter_value alt_vip_cl_scl_0 LOAD_AT_RUNTIME 0
set_instance_parameter_value alt_vip_cl_scl_0 MAX_IN_HEIGHT 1080
set_instance_parameter_value alt_vip_cl_scl_0 MAX_IN_WIDTH 1920
set_instance_parameter_value alt_vip_cl_scl_0 MAX_OUT_HEIGHT 1080
set_instance_parameter_value alt_vip_cl_scl_0 MAX_OUT_WIDTH 1920
set_instance_parameter_value alt_vip_cl_scl_0 NO_BLANKING 0
set_instance_parameter_value alt_vip_cl_scl_0 PIXELS_IN_PARALLEL 4
set_instance_parameter_value alt_vip_cl_scl_0 PRESERVE_BITS 0
set_instance_parameter_value alt_vip_cl_scl_0 RUNTIME_CONTROL 1
set_instance_parameter_value alt_vip_cl_scl_0 SYMBOLS_IN_PAR 3
set_instance_parameter_value alt_vip_cl_scl_0 SYMBOLS_IN_SEQ 1
set_instance_parameter_value alt_vip_cl_scl_0 USER_PACKET_FIFO_DEPTH 0
set_instance_parameter_value alt_vip_cl_scl_0 USER_PACKET_SUPPORT NONE_ALLOWED
set_instance_parameter_value alt_vip_cl_scl_0 V_BANKS 1
set_instance_parameter_value alt_vip_cl_scl_0 V_COEFF_FILE {<enter file name (including full path)>}
set_instance_parameter_value alt_vip_cl_scl_0 V_FRACTION_BITS 7
set_instance_parameter_value alt_vip_cl_scl_0 V_FUNCTION LANCZOS_2
set_instance_parameter_value alt_vip_cl_scl_0 V_INTEGER_BITS 1
set_instance_parameter_value alt_vip_cl_scl_0 V_PHASES 16
set_instance_parameter_value alt_vip_cl_scl_0 V_SIGNED 1
set_instance_parameter_value alt_vip_cl_scl_0 V_SYMMETRIC 0
set_instance_parameter_value alt_vip_cl_scl_0 V_TAPS 8

add_instance alt_vip_cl_scl_1 alt_vip_cl_scl 18.1
set_instance_parameter_value alt_vip_cl_scl_1 ALGORITHM_NAME BILINEAR
set_instance_parameter_value alt_vip_cl_scl_1 ALWAYS_DOWNSCALE 0
set_instance_parameter_value alt_vip_cl_scl_1 ARE_IDENTICAL 0
set_instance_parameter_value alt_vip_cl_scl_1 BITS_PER_SYMBOL 8
set_instance_parameter_value alt_vip_cl_scl_1 DEFAULT_EDGE_THRESH 7
set_instance_parameter_value alt_vip_cl_scl_1 DEFAULT_LOWER_BLUR 0
set_instance_parameter_value alt_vip_cl_scl_1 DEFAULT_UPPER_BLUR 0
set_instance_parameter_value alt_vip_cl_scl_1 ENABLE_FIR 0
set_instance_parameter_value alt_vip_cl_scl_1 EXTRA_PIPELINING 1
set_instance_parameter_value alt_vip_cl_scl_1 FAMILY {Cyclone V}
set_instance_parameter_value alt_vip_cl_scl_1 H_BANKS 1
set_instance_parameter_value alt_vip_cl_scl_1 H_COEFF_FILE {<enter file name (including full path)>}
set_instance_parameter_value alt_vip_cl_scl_1 H_FRACTION_BITS 7
set_instance_parameter_value alt_vip_cl_scl_1 H_FUNCTION LANCZOS_2
set_instance_parameter_value alt_vip_cl_scl_1 H_INTEGER_BITS 1
set_instance_parameter_value alt_vip_cl_scl_1 H_PHASES 16
set_instance_parameter_value alt_vip_cl_scl_1 H_SIGNED 1
set_instance_parameter_value alt_vip_cl_scl_1 H_SYMMETRIC 0
set_instance_parameter_value alt_vip_cl_scl_1 H_TAPS 8
set_instance_parameter_value alt_vip_cl_scl_1 IS_420 0
set_instance_parameter_value alt_vip_cl_scl_1 IS_422 0
set_instance_parameter_value alt_vip_cl_scl_1 LIMITED_READBACK 0
set_instance_parameter_value alt_vip_cl_scl_1 LOAD_AT_RUNTIME 0
set_instance_parameter_value alt_vip_cl_scl_1 MAX_IN_HEIGHT 1080
set_instance_parameter_value alt_vip_cl_scl_1 MAX_IN_WIDTH 1920
set_instance_parameter_value alt_vip_cl_scl_1 MAX_OUT_HEIGHT 1080
set_instance_parameter_value alt_vip_cl_scl_1 MAX_OUT_WIDTH 1920
set_instance_parameter_value alt_vip_cl_scl_1 NO_BLANKING 0
set_instance_parameter_value alt_vip_cl_scl_1 PIXELS_IN_PARALLEL 4
set_instance_parameter_value alt_vip_cl_scl_1 PRESERVE_BITS 0
set_instance_parameter_value alt_vip_cl_scl_1 RUNTIME_CONTROL 1
set_instance_parameter_value alt_vip_cl_scl_1 SYMBOLS_IN_PAR 3
set_instance_parameter_value alt_vip_cl_scl_1 SYMBOLS_IN_SEQ 1
set_instance_parameter_value alt_vip_cl_scl_1 USER_PACKET_FIFO_DEPTH 0
set_instance_parameter_value alt_vip_cl_scl_1 USER_PACKET_SUPPORT NONE_ALLOWED
set_instance_parameter_value alt_vip_cl_scl_1 V_BANKS 1
set_instance_parameter_value alt_vip_cl_scl_1 V_COEFF_FILE {<enter file name (including full path)>}
set_instance_parameter_value alt_vip_cl_scl_1 V_FRACTION_BITS 7
set_instance_parameter_value alt_vip_cl_scl_1 V_FUNCTION LANCZOS_2
set_instance_parameter_value alt_vip_cl_scl_1 V_INTEGER_BITS 1
set_instance_parameter_value alt_vip_cl_scl_1 V_PHASES 16
set_instance_parameter_value alt_vip_cl_scl_1 V_SIGNED 1
set_instance_parameter_value alt_vip_cl_scl_1 V_SYMMETRIC 0
set_instance_parameter_value alt_vip_cl_scl_1 V_TAPS 8

add_instance alt_vip_cl_vfb_0 alt_vip_cl_vfb 18.1
set_instance_parameter_value alt_vip_cl_vfb_0 CLOCKS_ARE_SEPARATE 0
set_instance_parameter_value alt_vip_cl_vfb_0 DROP_FRAMES 1
set_instance_parameter_value alt_vip_cl_vfb_0 DROP_INVALID_FIELDS 1
set_instance_parameter_value alt_vip_cl_vfb_0 DROP_REPEAT_USER 0
set_instance_parameter_value alt_vip_cl_vfb_0 IS_FRAME_READER 0
set_instance_parameter_value alt_vip_cl_vfb_0 LINE_BASED_BUFFERING 0
set_instance_parameter_value alt_vip_cl_vfb_0 MAX_HEIGHT 1080
set_instance_parameter_value alt_vip_cl_vfb_0 MAX_WIDTH 1920
set_instance_parameter_value alt_vip_cl_vfb_0 MEM_BASE_ADDR 0
set_instance_parameter_value alt_vip_cl_vfb_0 MEM_BUFFER_OFFSET 16777216
set_instance_parameter_value alt_vip_cl_vfb_0 MEM_PORT_WIDTH 128
set_instance_parameter_value alt_vip_cl_vfb_0 PIXELS_IN_PARALLEL 4
set_instance_parameter_value alt_vip_cl_vfb_0 PRIORITIZE_FMAX 0
set_instance_parameter_value alt_vip_cl_vfb_0 READER_RUNTIME_CONTROL 0
set_instance_parameter_value alt_vip_cl_vfb_0 READ_BURST_TARGET 8
set_instance_parameter_value alt_vip_cl_vfb_0 READ_FIFO_DEPTH 256
set_instance_parameter_value alt_vip_cl_vfb_0 USER_PACKETS_MAX_STORAGE 0
set_instance_parameter_value alt_vip_cl_vfb_0 USE_BUFFER_OFFSET 0
set_instance_parameter_value alt_vip_cl_vfb_0 WRITE_BURST_TARGET 8
set_instance_parameter_value alt_vip_cl_vfb_0 WRITE_FIFO_DEPTH 256

add_instance alt_vip_cl_vfb_1 alt_vip_cl_vfb 18.1
set_instance_parameter_value alt_vip_cl_vfb_1 CLOCKS_ARE_SEPARATE 0
set_instance_parameter_value alt_vip_cl_vfb_1 DROP_FRAMES 1
set_instance_parameter_value alt_vip_cl_vfb_1 DROP_INVALID_FIELDS 1
set_instance_parameter_value alt_vip_cl_vfb_1 DROP_REPEAT_USER 0
set_instance_parameter_value alt_vip_cl_vfb_1 IS_FRAME_READER 0
set_instance_parameter_value alt_vip_cl_vfb_1 LINE_BASED_BUFFERING 0
set_instance_parameter_value alt_vip_cl_vfb_1 MAX_HEIGHT 1080
set_instance_parameter_value alt_vip_cl_vfb_1 MAX_WIDTH 1920
set_instance_parameter_value alt_vip_cl_vfb_1 MEM_BASE_ADDR 33554432
set_instance_parameter_value alt_vip_cl_vfb_1 MEM_BUFFER_OFFSET 16777216
set_instance_parameter_value alt_vip_cl_vfb_1 MEM_PORT_WIDTH 128
set_instance_parameter_value alt_vip_cl_vfb_1 PIXELS_IN_PARALLEL 4
set_instance_parameter_value alt_vip_cl_vfb_1 PRIORITIZE_FMAX 0
set_instance_parameter_value alt_vip_cl_vfb_1 READER_RUNTIME_CONTROL 0
set_instance_parameter_value alt_vip_cl_vfb_1 READ_BURST_TARGET 8
set_instance_parameter_value alt_vip_cl_vfb_1 READ_FIFO_DEPTH 256
set_instance_parameter_value alt_vip_cl_vfb_1 USER_PACKETS_MAX_STORAGE 0
set_instance_parameter_value alt_vip_cl_vfb_1 USE_BUFFER_OFFSET 0
set_instance_parameter_value alt_vip_cl_vfb_1 WRITE_BURST_TARGET 8
set_instance_parameter_value alt_vip_cl_vfb_1 WRITE_FIFO_DEPTH 256

add_instance alt_vip_cl_vfb_2 alt_vip_cl_vfb 18.1
set_instance_parameter_value alt_vip_cl_vfb_2 CLOCKS_ARE_SEPARATE 0
set_instance_parameter_value alt_vip_cl_vfb_2 DROP_FRAMES 1
set_instance_parameter_value alt_vip_cl_vfb_2 DROP_INVALID_FIELDS 1
set_instance_parameter_value alt_vip_cl_vfb_2 DROP_REPEAT_USER 0
set_instance_parameter_value alt_vip_cl_vfb_2 IS_FRAME_READER 0
set_instance_parameter_value alt_vip_cl_vfb_2 LINE_BASED_BUFFERING 0
set_instance_parameter_value alt_vip_cl_vfb_2 MAX_HEIGHT 1080
set_instance_parameter_value alt_vip_cl_vfb_2 MAX_WIDTH 1920
set_instance_parameter_value alt_vip_cl_vfb_2 MEM_BASE_ADDR 67108864
set_instance_parameter_value alt_vip_cl_vfb_2 MEM_BUFFER_OFFSET 16777216
set_instance_parameter_value alt_vip_cl_vfb_2 MEM_PORT_WIDTH 128
set_instance_parameter_value alt_vip_cl_vfb_2 NUMBER_OF_COLOR_PLANES 4
set_instance_parameter_value alt_vip_cl_vfb_2 PIXELS_IN_PARALLEL 4
set_instance_parameter_value alt_vip_cl_vfb_2 PRIORITIZE_FMAX 0
set_instance_parameter_value alt_vip_cl_vfb_2 READER_RUNTIME_CONTROL 0
set_instance_parameter_value alt_vip_cl_vfb_2 READ_BURST_TARGET 8
set_instance_parameter_value alt_vip_cl_vfb_2 READ_FIFO_DEPTH 256
set_instance_parameter_value alt_vip_cl_vfb_2 USER_PACKETS_MAX_STORAGE 0
set_instance_parameter_value alt_vip_cl_vfb_2 USE_BUFFER_OFFSET 0
set_instance_parameter_value alt_vip_cl_vfb_2 WRITE_BURST_TARGET 8
set_instance_parameter_value alt_vip_cl_vfb_2 WRITE_FIFO_DEPTH 256

add_instance alt_vip_cl_mixer_0 alt_vip_cl_mixer 18.1
set_instance_parameter_value alt_vip_cl_mixer_0 ALPHA_ENABLE 1
set_instance_parameter_value alt_vip_cl_mixer_0 ALPHA_STREAM_ENABLE0 0
set_instance_parameter_value alt_vip_cl_mixer_0 ALPHA_STREAM_ENABLE1 0
set_instance_parameter_value alt_vip_cl_mixer_0 ALPHA_STREAM_ENABLE10 0
set_instance_parameter_value alt_vip_cl_mixer_0 ALPHA_STREAM_ENABLE11 0
set_instance_parameter_value alt_vip_cl_mixer_0 ALPHA_STREAM_ENABLE12 0
set_instance_parameter_value alt_vip_cl_mixer_0 ALPHA_STREAM_ENABLE13 0
set_instance_parameter_value alt_vip_cl_mixer_0 ALPHA_STREAM_ENABLE14 0
set_instance_parameter_value alt_vip_cl_mixer_0 ALPHA_STREAM_ENABLE15 0
set_instance_parameter_value alt_vip_cl_mixer_0 ALPHA_STREAM_ENABLE16 0
set_instance_parameter_value alt_vip_cl_mixer_0 ALPHA_STREAM_ENABLE17 0
set_instance_parameter_value alt_vip_cl_mixer_0 ALPHA_STREAM_ENABLE18 0
set_instance_parameter_value alt_vip_cl_mixer_0 ALPHA_STREAM_ENABLE19 0
set_instance_parameter_value alt_vip_cl_mixer_0 ALPHA_STREAM_ENABLE2 1
set_instance_parameter_value alt_vip_cl_mixer_0 ALPHA_STREAM_ENABLE3 1
set_instance_parameter_value alt_vip_cl_mixer_0 ALPHA_STREAM_ENABLE4 0
set_instance_parameter_value alt_vip_cl_mixer_0 ALPHA_STREAM_ENABLE5 0
set_instance_parameter_value alt_vip_cl_mixer_0 ALPHA_STREAM_ENABLE6 0
set_instance_parameter_value alt_vip_cl_mixer_0 ALPHA_STREAM_ENABLE7 0
set_instance_parameter_value alt_vip_cl_mixer_0 ALPHA_STREAM_ENABLE8 0
set_instance_parameter_value alt_vip_cl_mixer_0 ALPHA_STREAM_ENABLE9 0
set_instance_parameter_value alt_vip_cl_mixer_0 BITS_PER_SYMBOL 8
set_instance_parameter_value alt_vip_cl_mixer_0 COLOR_PLANES_ARE_IN_PARALLEL 1
set_instance_parameter_value alt_vip_cl_mixer_0 COLOR_SPACE RGB
set_instance_parameter_value alt_vip_cl_mixer_0 DATA_PIPELINE_STAGES 0
set_instance_parameter_value alt_vip_cl_mixer_0 FAMILY {Cyclone V}
set_instance_parameter_value alt_vip_cl_mixer_0 IS_422 0
set_instance_parameter_value alt_vip_cl_mixer_0 LAYER_POSITION_ENABLE 0
set_instance_parameter_value alt_vip_cl_mixer_0 LIMITED_READBACK 0
set_instance_parameter_value alt_vip_cl_mixer_0 LOW_LATENCY_MODE 0
set_instance_parameter_value alt_vip_cl_mixer_0 MAX_HEIGHT 1080
set_instance_parameter_value alt_vip_cl_mixer_0 MAX_WIDTH 1920
set_instance_parameter_value alt_vip_cl_mixer_0 NO_OF_INPUTS 3
set_instance_parameter_value alt_vip_cl_mixer_0 NUMBER_OF_COLOR_PLANES 2
set_instance_parameter_value alt_vip_cl_mixer_0 PATTERN uniform
set_instance_parameter_value alt_vip_cl_mixer_0 PIPELINE_READY 1
set_instance_parameter_value alt_vip_cl_mixer_0 PIXELS_IN_PARALLEL 4
set_instance_parameter_value alt_vip_cl_mixer_0 UNIFORM_VALUE_BCR 255
set_instance_parameter_value alt_vip_cl_mixer_0 UNIFORM_VALUE_GCB 0
set_instance_parameter_value alt_vip_cl_mixer_0 UNIFORM_VALUE_RY 0
set_instance_parameter_value alt_vip_cl_mixer_0 USER_PACKET_FIFO_DEPTH 0
set_instance_parameter_value alt_vip_cl_mixer_0 USER_PACKET_SUPPORT NONE_ALLOWED

add_instance bond_ifc_0 bond_ifc 1.0

add_instance mem_if_ddr3_emif_0 altera_mem_if_ddr3_emif 18.1
set_instance_parameter_value mem_if_ddr3_emif_0 AVL_DATA_WIDTH_PORT 64,32,32,32,32,32
set_instance_parameter_value mem_if_ddr3_emif_0 AVL_MAX_SIZE 8
set_instance_parameter_value mem_if_ddr3_emif_0 BYTE_ENABLE false
set_instance_parameter_value mem_if_ddr3_emif_0 CALIBRATION_MODE Skip
set_instance_parameter_value mem_if_ddr3_emif_0 CFG_REORDER_DATA false
set_instance_parameter_value mem_if_ddr3_emif_0 CORE_DEBUG_CONNECTION SHARED
set_instance_parameter_value mem_if_ddr3_emif_0 CPORT_TYPE_PORT Bidirectional,Read-only,Bidirectional,Bidirectional,Bidirectional,Bidirectional
set_instance_parameter_value mem_if_ddr3_emif_0 CTL_CSR_CONNECTION EXPORT
set_instance_parameter_value mem_if_ddr3_emif_0 ENABLE_BONDING true
set_instance_parameter_value mem_if_ddr3_emif_0 EXPORT_AFI_HALF_CLK false
set_instance_parameter_value mem_if_ddr3_emif_0 HARD_EMIF true
set_instance_parameter_value mem_if_ddr3_emif_0 MEM_BANKADDR_WIDTH 3
set_instance_parameter_value mem_if_ddr3_emif_0 MEM_CLK_FREQ 400.0
set_instance_parameter_value mem_if_ddr3_emif_0 MEM_CLK_FREQ_MAX 666.667
set_instance_parameter_value mem_if_ddr3_emif_0 MEM_COL_ADDR_WIDTH 10
set_instance_parameter_value mem_if_ddr3_emif_0 MEM_DQ_WIDTH 16
set_instance_parameter_value mem_if_ddr3_emif_0 MEM_DRV_STR RZQ/6
set_instance_parameter_value mem_if_ddr3_emif_0 MEM_FORMAT DISCRETE
set_instance_parameter_value mem_if_ddr3_emif_0 MEM_ROW_ADDR_WIDTH 15
set_instance_parameter_value mem_if_ddr3_emif_0 MEM_RTT_NOM {ODT Disabled}
set_instance_parameter_value mem_if_ddr3_emif_0 MEM_RTT_WR {Dynamic ODT off}
set_instance_parameter_value mem_if_ddr3_emif_0 MEM_TCL 7
set_instance_parameter_value mem_if_ddr3_emif_0 MEM_TFAW_NS 37.5
set_instance_parameter_value mem_if_ddr3_emif_0 MEM_TRAS_NS 37.5
set_instance_parameter_value mem_if_ddr3_emif_0 MEM_TRCD_NS 13.125
set_instance_parameter_value mem_if_ddr3_emif_0 MEM_TRFC_NS 160.0
set_instance_parameter_value mem_if_ddr3_emif_0 MEM_TRP_NS 13.125
set_instance_parameter_value mem_if_ddr3_emif_0 MEM_TRRD_NS 7.5
set_instance_parameter_value mem_if_ddr3_emif_0 MEM_TRTP_NS 7.5
set_instance_parameter_value mem_if_ddr3_emif_0 MEM_TWTR 4
set_instance_parameter_value mem_if_ddr3_emif_0 MEM_VENDOR Micron
set_instance_parameter_value mem_if_ddr3_emif_0 MEM_VOLTAGE {1.35V DDR3L}
set_instance_parameter_value mem_if_ddr3_emif_0 MEM_WTCL 6
set_instance_parameter_value mem_if_ddr3_emif_0 PLL_LOCATION Top_Bottom
set_instance_parameter_value mem_if_ddr3_emif_0 POWER_OF_TWO_BUS true
set_instance_parameter_value mem_if_ddr3_emif_0 PRIORITY_PORT 1,2,1,1,1,1
set_instance_parameter_value mem_if_ddr3_emif_0 RATE Full
set_instance_parameter_value mem_if_ddr3_emif_0 REF_CLK_FREQ 100.0
set_instance_parameter_value mem_if_ddr3_emif_0 SPEED_GRADE 7
set_instance_parameter_value mem_if_ddr3_emif_0 TIMING_BOARD_AC_SKEW 0.02
set_instance_parameter_value mem_if_ddr3_emif_0 TIMING_BOARD_AC_TO_CK_SKEW 0.0
set_instance_parameter_value mem_if_ddr3_emif_0 TIMING_BOARD_DQ_TO_DQS_SKEW 0.0
set_instance_parameter_value mem_if_ddr3_emif_0 TIMING_BOARD_MAX_CK_DELAY 0.6
set_instance_parameter_value mem_if_ddr3_emif_0 TIMING_BOARD_MAX_DQS_DELAY 0.6
set_instance_parameter_value mem_if_ddr3_emif_0 TIMING_BOARD_SKEW_BETWEEN_DQS 0.02
set_instance_parameter_value mem_if_ddr3_emif_0 TIMING_BOARD_SKEW_CKDQS_DIMM_MAX 0.01
set_instance_parameter_value mem_if_ddr3_emif_0 TIMING_BOARD_SKEW_CKDQS_DIMM_MIN -0.01
set_instance_parameter_value mem_if_ddr3_emif_0 TIMING_BOARD_SKEW_WITHIN_DQS 0.02
set_instance_parameter_value mem_if_ddr3_emif_0 TIMING_TDH 100
set_instance_parameter_value mem_if_ddr3_emif_0 TIMING_TDQSCK 300
set_instance_parameter_value mem_if_ddr3_emif_0 TIMING_TDQSQ 150
set_instance_parameter_value mem_if_ddr3_emif_0 TIMING_TDQSS 0.25
set_instance_parameter_value mem_if_ddr3_emif_0 TIMING_TDS 25
set_instance_parameter_value mem_if_ddr3_emif_0 TIMING_TDSH 0.2
set_instance_parameter_value mem_if_ddr3_emif_0 TIMING_TDSS 0.2
set_instance_parameter_value mem_if_ddr3_emif_0 TIMING_TIH 200
set_instance_parameter_value mem_if_ddr3_emif_0 TIMING_TIS 125
set_instance_parameter_value mem_if_ddr3_emif_0 TIMING_TQSH 0.38
set_instance_parameter_value mem_if_ddr3_emif_0 USER_DEBUG_LEVEL 1
